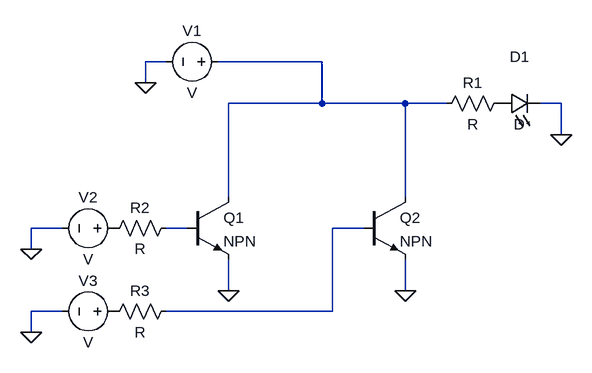
[diagram p0: schematic NOR_Gate.asc]
NOR_Gate.asc, the LTspice schematic file:
Version 4
SHEET 1 880 680
WIRE -16 -144 -48 -144
WIRE 224 -144 64 -144
WIRE -48 -112 -48 -144
WIRE 224 -80 224 -144
WIRE 224 -80 80 -80
WIRE 352 -80 224 -80
WIRE 416 -80 352 -80
WIRE 592 -80 560 -80
WIRE 592 -32 592 -80
WIRE 80 64 80 -80
WIRE 352 64 352 -80
WIRE -176 112 -224 112
WIRE 16 112 -16 112
WIRE 288 112 240 112
WIRE -224 144 -224 112
WIRE 80 208 80 160
WIRE 352 208 352 160
WIRE -176 240 -224 240
WIRE 240 240 240 112
WIRE 240 240 -16 240
WIRE -224 272 -224 240
FLAG 80 208 0
FLAG 352 208 0
FLAG -48 -112 0
FLAG 592 -32 0
FLAG -224 144 0
FLAG -224 272 0
SYMBOL npn 16 64 R0
SYMATTR InstName Q1
SYMBOL npn 288 64 R0
SYMATTR InstName Q2
SYMBOL res 512 -96 R90
WINDOW 0 0 56 VBottom 2
WINDOW 3 32 56 VTop 2
SYMATTR InstName R1
SYMBOL LED 496 -64 R270
WINDOW 0 72 32 VTop 2
WINDOW 3 0 32 VBottom 2
SYMATTR InstName D1
SYMBOL voltage 80 -144 R90
WINDOW 0 -32 56 VBottom 2
WINDOW 3 32 56 VTop 2
SYMATTR InstName V1
SYMBOL voltage -80 112 R90
WINDOW 0 -32 56 VBottom 2
WINDOW 3 32 56 VTop 2
SYMATTR InstName V2
SYMBOL voltage -80 240 R90
WINDOW 0 -32 56 VBottom 2
WINDOW 3 32 56 VTop 2
SYMATTR InstName V3
SYMBOL res 0 96 R90
WINDOW 0 0 56 VBottom 2
WINDOW 3 32 56 VTop 2
SYMATTR InstName R2
SYMBOL res 0 224 R90
WINDOW 0 0 56 VBottom 2
WINDOW 3 32 56 VTop 2
SYMATTR InstName R3

The netlist it stands for:
* NOR_Gate.asc
Q1 N001 N002 0 0 NPN
Q2 N001 N003 0 0 NPN
R1 P001 N001 R
D1 P001 0 D
V1 N001 0 V
V2 P002 0 V
V3 P003 0 V
R2 N002 P002 R
R3 N003 P003 R
.model D D
.lib standard.dio
.model NPN NPN
.model PNP PNP
.lib standard.bjt
.backanno
.end